# Altium project HS-IO Baseboard.PrjPcb
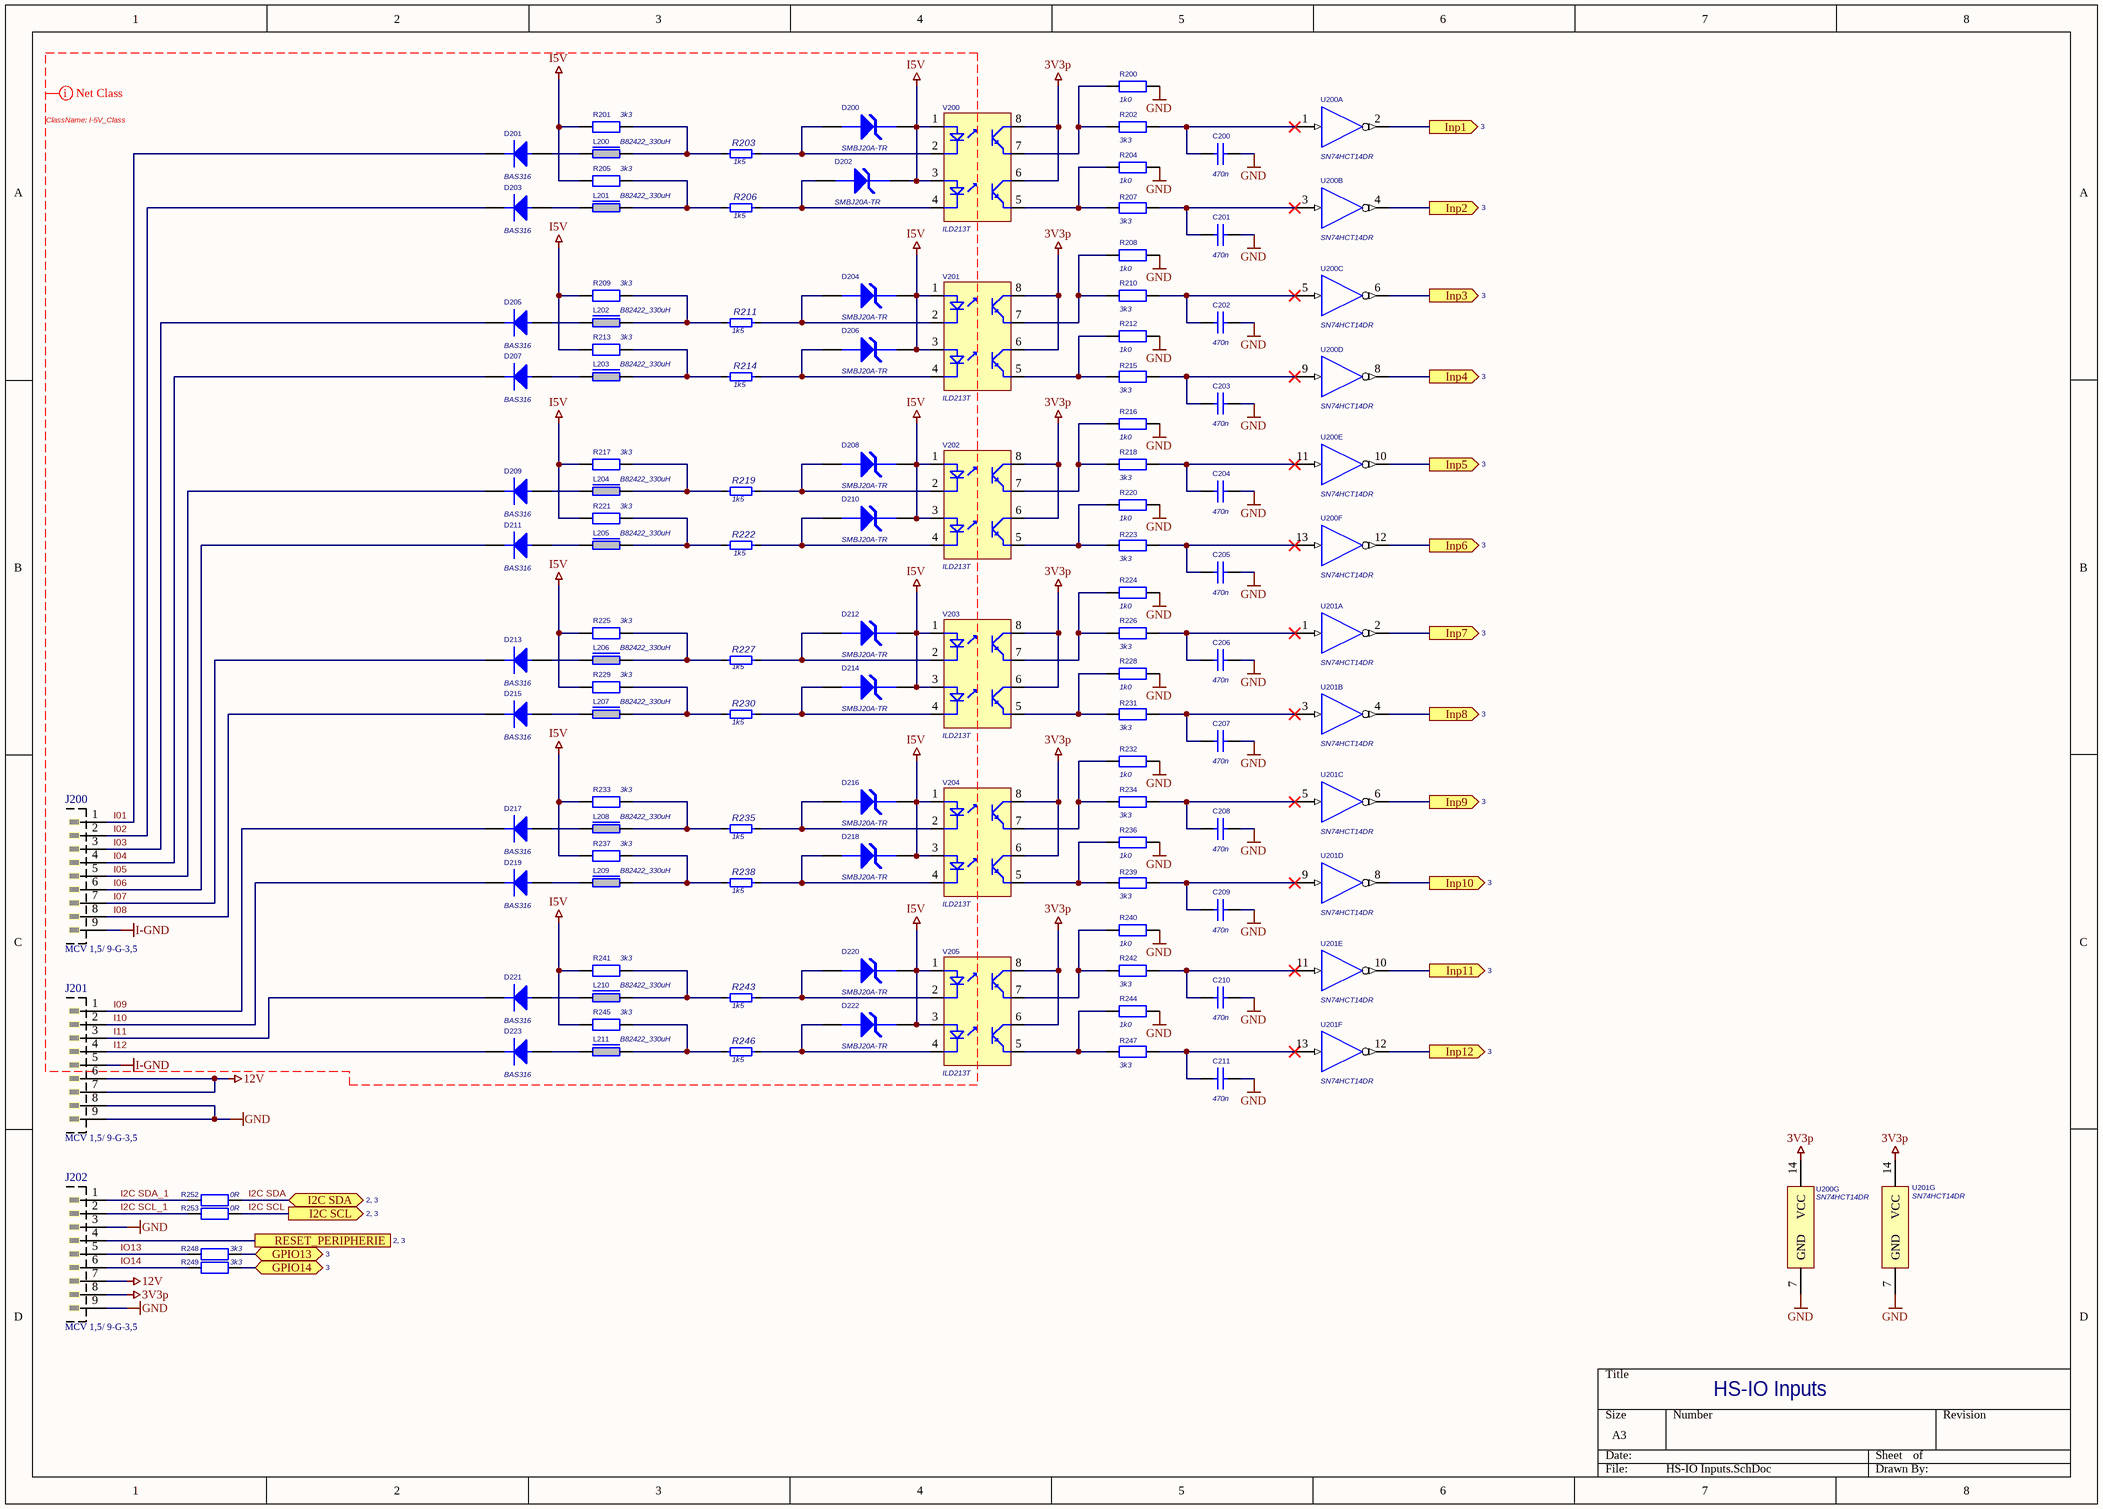
[diagram p0: HS-IO Inputs.SchDoc]
Designer: S .Waltersberger; Version: 1.1
3 sheets, 214 parts. Net scope: flat (ports and power ports of the same name join across sheets).
Board file: HS-IO-BaseBoard.PcbDoc
Sheets:
  HS-IO Inputs.SchDoc
  HS-IO Outputs.SchDoc
  HS-IO ESP32.SchDoc

## Sheet HS-IO Inputs.SchDoc
size A3; SheetNumber: 1; SheetTotal: 3

### Parts
C200  470n  [CC1608-0603]
C201  470n  [CC1608-0603]
C202  470n  [CC1608-0603]
C203  470n  [CC1608-0603]
C204  470n  [CC1608-0603]
C205  470n  [CC1608-0603]
C206  470n  [CC1608-0603]
C207  470n  [CC1608-0603]
C208  470n  [CC1608-0603]
C209  470n  [CC1608-0603]
C210  470n  [CC1608-0603]
C211  470n  [CC1608-0603]
D200  SMBJ20A-TR  [SMB]
D201  BAS316  [SOD323F]
D202  SMBJ20A-TR  [SMB]
D203  BAS316  [SOD323F]
D204  SMBJ20A-TR  [SMB]
D205  BAS316  [SOD323F]
D206  SMBJ20A-TR  [SMB]
D207  BAS316  [SOD323F]
D208  SMBJ20A-TR  [SMB]
D209  BAS316  [SOD323F]
D210  SMBJ20A-TR  [SMB]
D211  BAS316  [SOD323F]
D212  SMBJ20A-TR  [SMB]
D213  BAS316  [SOD323F]
D214  SMBJ20A-TR  [SMB]
D215  BAS316  [SOD323F]
D216  SMBJ20A-TR  [SMB]
D217  BAS316  [SOD323F]
D218  SMBJ20A-TR  [SMB]
D219  BAS316  [SOD323F]
D220  SMBJ20A-TR  [SMB]
D221  BAS316  [SOD323F]
D222  SMBJ20A-TR  [SMB]
D223  BAS316  [SOD323F]
J200  MCV 1,5/ 9-G-3,5  [MCV1,5/9-G-3,5 - I]
J201  MCV 1,5/ 9-G-3,5  [MCV1,5/9-G-3,5 - I]
J202  MCV 1,5/ 9-G-3,5  [MCV1,5/9-G-3,5 - I]
L200  B82422_330uH  [CR3225-1210]
L201  B82422_330uH  [CR3225-1210]
L202  B82422_330uH  [CR3225-1210]
L203  B82422_330uH  [CR3225-1210]
L204  B82422_330uH  [CR3225-1210]
L205  B82422_330uH  [CR3225-1210]
L206  B82422_330uH  [CR3225-1210]
L207  B82422_330uH  [CR3225-1210]
L208  B82422_330uH  [CR3225-1210]
L209  B82422_330uH  [CR3225-1210]
L210  B82422_330uH  [CR3225-1210]
L211  B82422_330uH  [CR3225-1210]
R200  1k0  [CR1608-0603]
R201  3k3  [CR1608-0603]
R202  3k3  [CR1608-0603]
R203  1k5  [CR1608-0603]
R204  1k0  [CR1608-0603]
R205  3k3  [CR1608-0603]
R206  1k5  [CR1608-0603]
R207  3k3  [CR1608-0603]
R208  1k0  [CR1608-0603]
R209  3k3  [CR1608-0603]
R210  3k3  [CR1608-0603]
R211  1k5  [CR1608-0603]
R212  1k0  [CR1608-0603]
R213  3k3  [CR1608-0603]
R214  1k5  [CR1608-0603]
R215  3k3  [CR1608-0603]
R216  1k0  [CR1608-0603]
R217  3k3  [CR1608-0603]
R218  3k3  [CR1608-0603]
R219  1k5  [CR1608-0603]
R220  1k0  [CR1608-0603]
R221  3k3  [CR1608-0603]
R222  1k5  [CR1608-0603]
R223  3k3  [CR1608-0603]
R224  1k0  [CR1608-0603]
R225  3k3  [CR1608-0603]
R226  3k3  [CR1608-0603]
R227  1k5  [CR1608-0603]
R228  1k0  [CR1608-0603]
R229  3k3  [CR1608-0603]
R230  1k5  [CR1608-0603]
R231  3k3  [CR1608-0603]
R232  1k0  [CR1608-0603]
R233  3k3  [CR1608-0603]
R234  3k3  [CR1608-0603]
R235  1k5  [CR1608-0603]
R236  1k0  [CR1608-0603]
R237  3k3  [CR1608-0603]
R238  1k5  [CR1608-0603]
R239  3k3  [CR1608-0603]
R240  1k0  [CR1608-0603]
R241  3k3  [CR1608-0603]
R242  3k3  [CR1608-0603]
R243  1k5  [CR1608-0603]
R244  1k0  [CR1608-0603]
R245  3k3  [CR1608-0603]
R246  1k5  [CR1608-0603]
R247  3k3  [CR1608-0603]
R248  3k3  [CR1608-0603]
R249  3k3  [CR1608-0603]
R252  0R  [CR1608-0603]
R253  0R  [CR1608-0603]
U200  SN74HCT14DR  [SO14]  (parts A,B,C,D,E,F,G of 7)
U201  SN74HCT14DR  [SO14]  (parts A,B,C,D,E,F,G of 7)
V200  ILD213T  [SOIC8]
V201  ILD213T  [SOIC8]
V202  ILD213T  [SOIC8]
V203  ILD213T  [SOIC8]
V204  ILD213T  [SOIC8]
V205  ILD213T  [SOIC8]

### Ports
GPIO13 (bidir, see 3), GPIO14 (bidir, see 3), I2C SCL (out, see 2, 3), I2C SDA (bidir, see 2, 3), Inp1 (out, see 3), Inp2 (out, see 3), Inp3 (out, see 3), Inp4 (out, see 3), Inp5 (out, see 3), Inp6 (out, see 3), Inp7 (out, see 3), Inp8 (out, see 3), Inp9 (out, see 3), Inp10 (out, see 3), Inp11 (out, see 3), Inp12 (out, see 3), RESET_PERIPHERIE (see 2, 3)

### Nets
3V3p: J202.8 U200.14(VCC) U201.14(VCC) V200.6 V200.8(Vcc) V201.6 V201.8(Vcc) V202.6 V202.8(Vcc) V203.6 V203.8(Vcc) V204.6 V204.8(Vcc) V205.6 V205.8(Vcc)
12V: J201.6 J201.7 J202.7
GND: C200.2 C201.2 C202.2 C203.2 C204.2 C205.2 C206.2 C207.2 C208.2 C209.2 C210.2 C211.2 J201.8 J201.9 J202.3 J202.9 R200.2 R204.2 R208.2 R212.2 R216.2 R220.2 R224.2 R228.2 R232.2 R236.2 R240.2 R244.2 U200.7(GND) U201.7(GND)
I5V: D200.2(K) D202.2(K) D204.2(K) D206.2(K) D208.2(K) D210.2(K) D212.2(K) D214.2(K) D216.2(K) D218.2(K) D220.2(K) D222.2(K) R201.1 R205.1 R209.1 R213.1 R217.1 R221.1 R225.1 R229.1 R233.1 R237.1 R241.1 R245.1 V200.1 V200.3 V201.1 V201.3 V202.1 V202.3 V203.1 V203.3 V204.1 V204.3 V205.1 V205.3
I-GND: J200.9 J201.5
GPIO13: R248.2 ; port GPIO13
GPIO14: R249.2 ; port GPIO14
I01: D201.2(K) J200.1
I02: D203.2(K) J200.2
I2C SCL: R253.2 ; port I2C SCL
I2C SCL_1: J202.2 R253.1
I2C SDA: R252.2 ; port I2C SDA
I2C SDA_1: J202.1 R252.1
I03: D205.2(K) J200.3
I04: D207.2(K) J200.4
I05: D209.2(K) J200.5
I06: D211.2(K) J200.6
I07: D213.2(K) J200.7
I08: D215.2(K) J200.8
I09: D217.2(K) J201.1
I10: D219.2(K) J201.2
I11: D221.2(K) J201.3
I12: D223.2(K) J201.4
INP1: U200.2(Y) ; port Inp1
INP2: U200.4(Y) ; port Inp2
INP3: U200.6(Y) ; port Inp3
INP4: U200.8(Y) ; port Inp4
INP5: U200.10(Y) ; port Inp5
INP6: U200.12(Y) ; port Inp6
INP7: U201.2(Y) ; port Inp7
INP8: U201.4(Y) ; port Inp8
INP9: U201.6(Y) ; port Inp9
INP10: U201.8(Y) ; port Inp10
INP11: U201.10(Y) ; port Inp11
INP12: U201.12(Y) ; port Inp12
IO13: J202.5 R248.1
IO14: J202.6 R249.1
~{RESET}: J202.4 ; port RESET_PERIPHERIE
NetC200_1: C200.1 R202.2 U200.1(A)
NetC201_1: C201.1 R207.2 U200.3(A)
NetC202_1: C202.1 R210.2 U200.5(A)
NetC203_1: C203.1 R215.2 U200.9(A)
NetC204_1: C204.1 R218.2 U200.11(A)
NetC205_1: C205.1 R223.2 U200.13(A)
NetC206_1: C206.1 R226.2 U201.1(A)
NetC207_1: C207.1 R231.2 U201.3(A)
NetC208_1: C208.1 R234.2 U201.5(A)
NetC209_1: C209.1 R239.2 U201.9(A)
NetC210_1: C210.1 R242.2 U201.11(A)
NetC211_1: C211.1 R247.2 U201.13(A)
NetD200_1: D200.1(A) R203.2 V200.2
NetD201_1: D201.1(A) L200.1
NetD202_1: D202.1(A) R206.2 V200.4
NetD203_1: D203.1(A) L201.1
NetD204_1: D204.1(A) R211.2 V201.2
NetD205_1: D205.1(A) L202.1
NetD206_1: D206.1(A) R214.2 V201.4
NetD207_1: D207.1(A) L203.1
NetD208_1: D208.1(A) R219.2 V202.2
NetD209_1: D209.1(A) L204.1
NetD210_1: D210.1(A) R222.2 V202.4
NetD211_1: D211.1(A) L205.1
NetD212_1: D212.1(A) R227.2 V203.2
NetD213_1: D213.1(A) L206.1
NetD214_1: D214.1(A) R230.2 V203.4
NetD215_1: D215.1(A) L207.1
NetD216_1: D216.1(A) R235.2 V204.2
NetD217_1: D217.1(A) L208.1
NetD218_1: D218.1(A) R238.2 V204.4
NetD219_1: D219.1(A) L209.1
NetD220_1: D220.1(A) R243.2 V205.2
NetD221_1: D221.1(A) L210.1
NetD222_1: D222.1(A) R246.2 V205.4
NetD223_1: D223.1(A) L211.1
NetL200_2: L200.2 R201.2 R203.1
NetL201_2: L201.2 R205.2 R206.1
NetL202_2: L202.2 R209.2 R211.1
NetL203_2: L203.2 R213.2 R214.1
NetL204_2: L204.2 R217.2 R219.1
NetL205_2: L205.2 R221.2 R222.1
NetL206_2: L206.2 R225.2 R227.1
NetL207_2: L207.2 R229.2 R230.1
NetL208_2: L208.2 R233.2 R235.1
NetL209_2: L209.2 R237.2 R238.1
NetL210_2: L210.2 R241.2 R243.1
NetL211_2: L211.2 R245.2 R246.1
NetR200_1: R200.1 R202.1 V200.7
NetR204_1: R204.1 R207.1 V200.5
NetR208_1: R208.1 R210.1 V201.7
NetR212_1: R212.1 R215.1 V201.5
NetR216_1: R216.1 R218.1 V202.7
NetR220_1: R220.1 R223.1 V202.5
NetR224_1: R224.1 R226.1 V203.7
NetR228_1: R228.1 R231.1 V203.5
NetR232_1: R232.1 R234.1 V204.7
NetR236_1: R236.1 R239.1 V204.5
NetR240_1: R240.1 R242.1 V205.7
NetR244_1: R244.1 R247.1 V205.5

### Layout directives
net class I-5V_Class: I01, I02, I03, I04, I05, I5V, I06, I07, I08, I09, I10, I11, I12, I-GND

### Notes on the sheet
- HS-IO Inputs

### Library data of the parts
C200-C211 = CMP-018-000014-2: SMD0603, X7R, 15%, 50V, 470nF; Manufacturer: KEMET; Manufacturer Part Number: C0805C474K5RACAUTO; Kommentar: Kondensator aus mehreren Keramikschichten MLCC - SMD/SMT 50V 0.47uF X7R 0805 10% AEC-Q200; ComponentLink1Description: Manufacturer Link; ComponentLink1URL: https://www.kemet.com; ComponentLink2Description: Datasheet; ComponentLink2URL: https://www.mouser.de/datasheet/2/447/KEM_C1023_X7R_AUTO_SMD-3316698.pdf; Supplier Order Number: 80-C0805C474K5RAUTO; Supplier Price 100pcs: 0,084 €; E01_Value_1: 470n; Supplier: Mouser
D200 D202 D204 D206 D208 D210 D212 D214 D216 D218 D220 D222 = SMBJ20A: 20V UNIDIRECTIONAL TRANSIENT VOLTAGE SUPPRESSOR; Manufacturer: STMicroelectronics; Kommentar: ESD-Entstörer/TVS-Dioden Transil; ComponentLink1Description: Manufacturer Link; ComponentLink1URL: https://www.st.com/; ComponentLink2Description: Datasheet; ComponentLink2URL: https://www.mouser.de/datasheet/2/389/cd00001366-1795574.pdf; E01_Value_1: SMBJ20A-TR; Manufacturer Part Number: SMBJ20A-TR; Supplier: Mouser; Supplier Order Number: 511-SMBJ20A-TR; Supplier Price 100pcs: 0,24 €
D201 D203 D205 D207 D209 D211 D213 D215 D217 D219 D221 D223 = BAS316: Small Signal Fast Switching Diodes 250mA; Manufacturer: Nexperia; Manufacturer Part Number: BAS316,135; Kommentar: Dioden (Allzweck, Leistung, Schaltung) BAS316/SOD323/SOD2; ComponentLink1Description: Manufacturer Link; ComponentLink1URL: https://www.nxp.com/; ComponentLink2Description: Datasheet; ComponentLink2URL: https://www.mouser.de/datasheet/2/916/BAS316-3081362.pdf; E01_Value_1: BAS316; Supplier: Mouser; Supplier Order Number: 771-BAS316135; Supplier Price 100pcs: 0,034 €
J200-J202 = CMP-019-000007-1: Phoneix Contact 9 pole connector Male RM3,5; Manufacturer Part Number: 1843677; Manufacturer: Phoenix Contact; Kommentar: Steckbare Anschlussblöcke 9 Pos 3.5mm pitch Through Hole Header; E01_Value_1: MCV 1,5/ 9-G-3,5; ComponentLink1URL: http://www.phoenixcontact.de/; ComponentLink2Description: Datasheet; Supplier Order Number: 651-1843677; ComponentLink1Description: Manufacturer Link; Supplier Price 100pcs: 2,81 €; ComponentLink2URL: https://www.phoenixcontact.com/us/products/1843677/pdf; Supplier: Mouser
L200-L211 = CMP-023-000002-2: HF-Induktivitäten – SMD SMT-INDUCTOR1210-H 330UH 5%, AEC-Q200; Manufacturer: EPCOS / TDK; Manufacturer Part Number: B82422H1334J000; E01_Value_1: B82422-H1334; ComponentLink1Description: Manufacturer Link; ComponentLink1URL: https://www.tdk-electronics.tdk.com; ComponentLink2Description: Datasheet; ComponentLink2URL: https://product.tdk.com/system/files/dam/doc/product/inductor/inductor/smd/data_sheet/30/db/ind_2008/b82422h.pdf?ref_disty=mouser; Supplier Order Number: 871-B82422H1334J000; Supplier Price 100pcs: 0,32 €; Kommentar: HF-Induktivitäten – SMD SMT-INDUCTOR1210-H 330UH 5%, AEC-Q200; Supplier: Mouser
R200 R204 R208 R212 R216 R220 R224 R228 R232 R236 R240 R244 = S0603_1k0_1_1: SMD0603, 0.1W, TK100, 1%, 1,0k, Metallfilm; Manufacturer: Vishay / Dale; Manufacturer Part Number: CRCW06031K00FKEAC; Kommentar: Dickfilmwiderstände - SMD 1/10Watt 1Kohms 1% Commercial Use; ComponentLink1Description: Manufacturer Link; ComponentLink2Description: Datasheet; ComponentLink2URL: https://www.vishay.com/docs/20035/dcrcwe3.pdf; Supplier: Mouser; Supplier Order Number: 71-CRCW06031K00FKEAC; Supplier Price 100pcs: 0,007 €; E01_Value_1: 1k0; ComponentLink1URL: https://www.vishay.com/
R201 R202 R205 R207 R209 R210 R213 R215 R217 R218 R221 R223 R225 R226 R229 R231 R233 R234 R237 R239 R241 R242 R245 R247-R249 = S0603_3k3_1: Resistor; Manufacturer: Vishay / Dale; Manufacturer Part Number: CRCW06033K30FKEBC; Kommentar: Dickfilmwiderstände - SMD 1/10Watt 3.3Kohms 1% Commercial Use; ComponentLink1Description: Manufacturer Link; ComponentLink1URL: https://www.vishay.com/; ComponentLink2Description: Datasheet; ComponentLink2URL: https://www.vishay.com/docs/20035/dcrcwe3.pdf; E01_Value_1: 3k3; Supplier: Mouser; Supplier Order Number: 71-CRCW06033K30FKEBC; Supplier Price 100pcs: 0,012 €
R203 R206 R211 R214 R219 R222 R227 R230 R235 R238 R243 R246 = CMP-012-000010-3: Resistor; Manufacturer: Vishay / Dale; Manufacturer Part Number: CRCW06031K50FKEAC; Kommentar: Dickfilmwiderstände - SMD 1/10Watt 1.5Kohms 1% Commercial Use; ComponentLink1Description: Manufacturer Link; ComponentLink1URL: https://www.vishay.com/; ComponentLink2Description: Datasheet; ComponentLink2URL: https://www.vishay.com/docs/20035/dcrcwe3.pdf; E01_Value_1: 1k5; Supplier Order Number: 71-CRCW06031K50FKEAC; Supplier Price 100pcs: 0,008 €; Supplier: Mouser
R252 R253 = CMP-038-000000-2: SMD0603, 0.1W, TK100, 1%, 0 Ohm, Metallfilm; Manufacturer Part Number: MCT0603MZ0000ZP500; Manufacturer: Vishay / Beyschlag; Kommentar: Dünnfilmwiderstände - SMD .1W ZEROohm Jumper; ComponentLink1URL: https://www.vishay.com/; Supplier Price 100pcs: 0,052 €; Supplier Order Number: 594-MCT0603MZ0000ZP5; ComponentLink2URL: https://www.vishay.com/docs/28952/mcs0402at-mct0603at-mcu0805at-mca1206at.pdf; ComponentLink2Description: Datasheet; ComponentLink1Description: Manufacturer Link; E01_Value_1: 0R; Supplier: Mouser
U200 U201 = 74HCT14D: Hex Schmitt-Trigger Inverter; Manufacturer: Texas Instruments; Kommentar: Inverter Hex Schmitt-Trigger Inverter; ComponentLink1Description: Manufacturer Link; ComponentLink1URL: https://www.nxp.com/; ComponentLink2Description: Datasheet; ComponentLink2URL: https://www.ti.com/lit/gpn/sn74hct14; E01_Value_1: SN74HCT14DR; Manufacturer Part Number: SN74HCT14DR; Supplier: Mouser; Supplier Order Number: 595-SN74HCT14DR; Supplier Price 100pcs: 0,119 €
V200-V205 = ILD213T: Dual SMD Optocoupler CTR > 100%; Manufacturer: Vishay Semiconductors; Kommentar: Transistor-Ausgangsoptokoppler Phototransistor Out Dual CTR >100%; ComponentLink1Description: Manufacturer Link; ComponentLink1URL: https://www.vishay.com/; ComponentLink2Description: Datasheet; ComponentLink2URL: https://www.vishay.com/doc?83647; E01_Value_1: ILD213T; Manufacturer Part Number: ILD213T; Supplier: Mouser; Supplier Order Number: 782-ILD213T; Supplier Price 100pcs: 0,586 €

## Sheet HS-IO Outputs.SchDoc
size A3; SheetNumber: 2; SheetTotal: 3
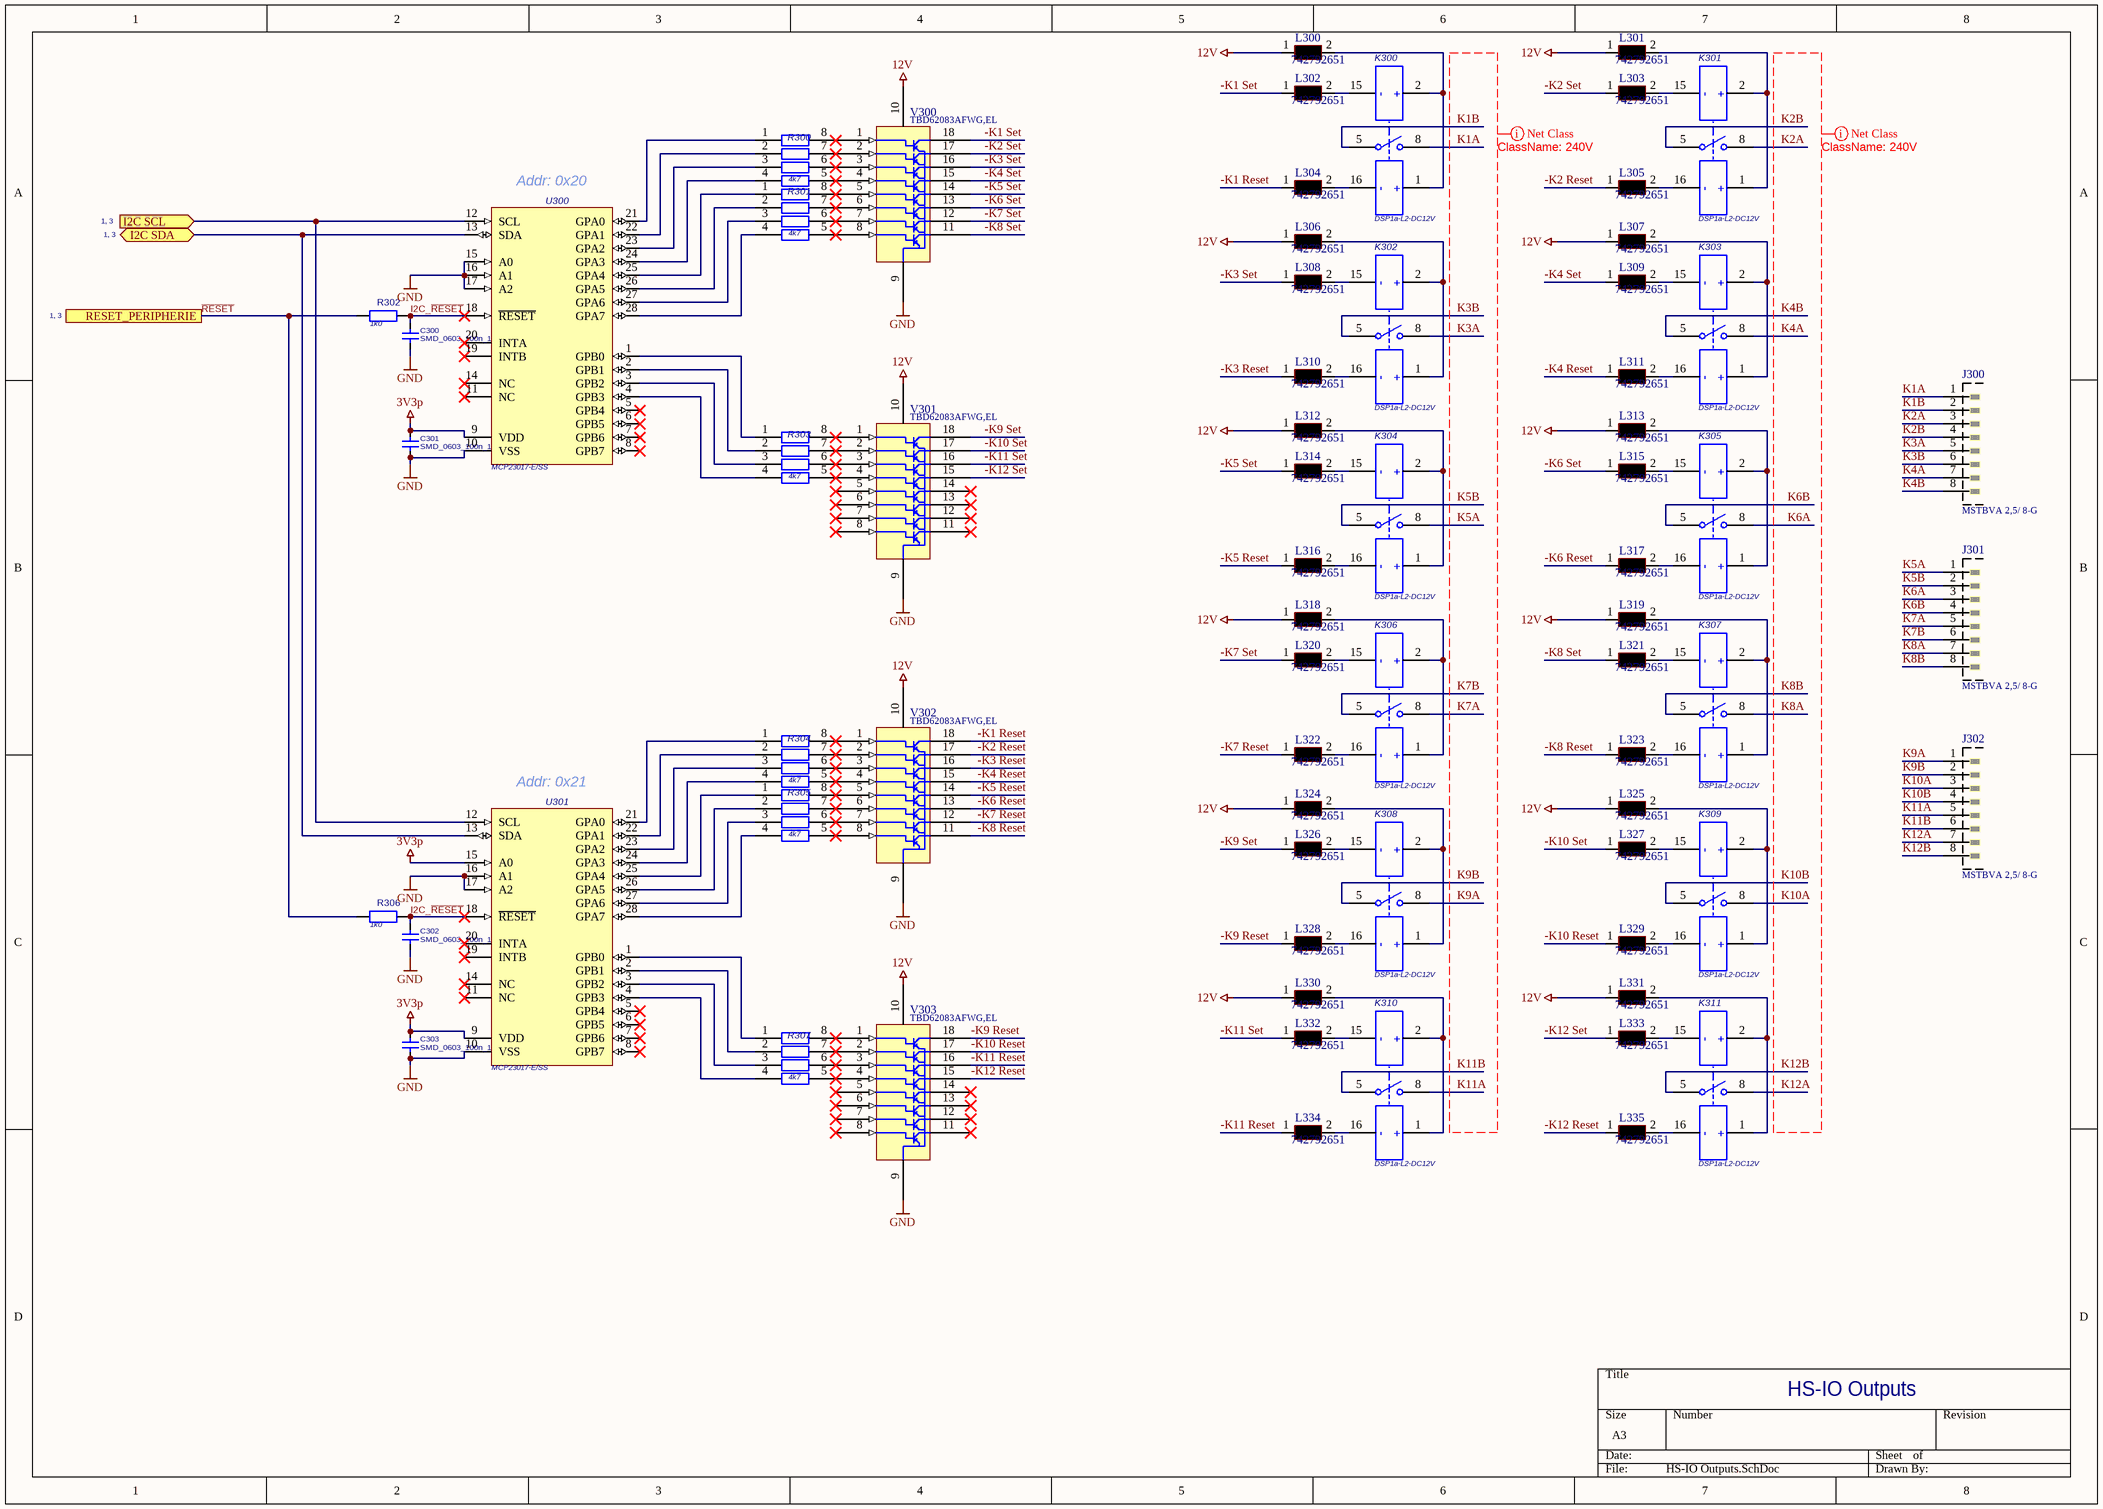
[diagram p1: HS-IO Outputs.SchDoc]

### Parts
C300  SMD_0603_100n_1  [CC1608-0603]
C301  SMD_0603_100n_1  [CC1608-0603]
C302  SMD_0603_100n_1  [CC1608-0603]
C303  SMD_0603_100n_1  [CC1608-0603]
J300  MSTBVA 2,5/ 8-G  [MSTBVA2,5/8-G - I]
J301  MSTBVA 2,5/ 8-G  [MSTBVA2,5/8-G - I]
J302  MSTBVA 2,5/ 8-G  [MSTBVA2,5/8-G - I]
K300  DSP1a-L2-DC12V  [DS-P16]
K301  DSP1a-L2-DC12V  [DS-P16]
K302  DSP1a-L2-DC12V  [DS-P16]
K303  DSP1a-L2-DC12V  [DS-P16]
K304  DSP1a-L2-DC12V  [DS-P16]
K305  DSP1a-L2-DC12V  [DS-P16]
K306  DSP1a-L2-DC12V  [DS-P16]
K307  DSP1a-L2-DC12V  [DS-P16]
K308  DSP1a-L2-DC12V  [DS-P16]
K309  DSP1a-L2-DC12V  [DS-P16]
K310  DSP1a-L2-DC12V  [DS-P16]
K311  DSP1a-L2-DC12V  [DS-P16]
L300  742792651  [0603-Ferrit]
L301  742792651  [0603-Ferrit]
L302  742792651  [0603-Ferrit]
L303  742792651  [0603-Ferrit]
L304  742792651  [0603-Ferrit]
L305  742792651  [0603-Ferrit]
L306  742792651  [0603-Ferrit]
L307  742792651  [0603-Ferrit]
L308  742792651  [0603-Ferrit]
L309  742792651  [0603-Ferrit]
L310  742792651  [0603-Ferrit]
L311  742792651  [0603-Ferrit]
L312  742792651  [0603-Ferrit]
L313  742792651  [0603-Ferrit]
L314  742792651  [0603-Ferrit]
L315  742792651  [0603-Ferrit]
L316  742792651  [0603-Ferrit]
L317  742792651  [0603-Ferrit]
L318  742792651  [0603-Ferrit]
L319  742792651  [0603-Ferrit]
L320  742792651  [0603-Ferrit]
L321  742792651  [0603-Ferrit]
L322  742792651  [0603-Ferrit]
L323  742792651  [0603-Ferrit]
L324  742792651  [0603-Ferrit]
L325  742792651  [0603-Ferrit]
L326  742792651  [0603-Ferrit]
L327  742792651  [0603-Ferrit]
L328  742792651  [0603-Ferrit]
L329  742792651  [0603-Ferrit]
L330  742792651  [0603-Ferrit]
L331  742792651  [0603-Ferrit]
L332  742792651  [0603-Ferrit]
L333  742792651  [0603-Ferrit]
L334  742792651  [0603-Ferrit]
L335  742792651  [0603-Ferrit]
R300  4k7  [ARV241]
R301  4k7  [ARV241]
R302  1k0  [CR1608-0603]
R303  4k7  [ARV241]
R304  4k7  [ARV241]
R305  4k7  [ARV241]
R306  1k0  [CR1608-0603]
R307  4k7  [ARV241]
U300  MCP23017-E/SS  [SSOP-SS28_M]
U301  MCP23017-E/SS  [SSOP-SS28_M]
V300  TBD62083AFWG,EL  [SOL-18]
V301  TBD62083AFWG,EL  [SOL-18]
V302  TBD62083AFWG,EL  [SOL-18]
V303  TBD62083AFWG,EL  [SOL-18]

### Ports
I2C SCL (in, see 1, 3), I2C SDA (bidir, see 1, 3), RESET_PERIPHERIE (see 1, 3)

### Nets
3V3p: C301.2 C303.2 U300.9(VDD) U301.9(VDD) U301.15(A0)
12V: L300.1 L301.1 L306.1 L307.1 L312.1 L313.1 L318.1 L319.1 L324.1 L325.1 L330.1 L331.1 V300.10 V301.10 V302.10 V303.10
GND: C300.1 C301.1 C302.1 C303.1 U300.10(VSS) U300.15(A0) U300.16(A1) U300.17(A2) U301.10(VSS) U301.16(A1) U301.17(A2) V300.9 V301.9 V302.9 V303.9
-K1 Reset: L304.1 V302.18
-K1 Set: L302.1 V300.18
-K2 Reset: L305.1 V302.17
-K2 Set: L303.1 V300.17
-K3 Reset: L310.1 V302.16
-K3 Set: L308.1 V300.16
-K4 Reset: L311.1 V302.15
-K4 Set: L309.1 V300.15
-K5 Reset: L316.1 V302.14
-K5 Set: L314.1 V300.14
-K6 Reset: L317.1 V302.13
-K6 Set: L315.1 V300.13
-K7 Reset: L322.1 V302.12
-K7 Set: L320.1 V300.12
-K8 Reset: L323.1 V302.11
-K8 Set: L321.1 V300.11
-K9 Reset: L328.1 V303.18
-K9 Set: L326.1 V301.18
-K10 Reset: L329.1 V303.17
-K10 Set: L327.1 V301.17
-K11 Reset: L334.1 V303.16
-K11 Set: L332.1 V301.16
-K12 Reset: L335.1 V303.15
-K12 Set: L333.1 V301.15
I2C SCL: U300.12(SCL) U301.12(SCL) ; port I2C SCL
I2C SDA: U300.13(SDA) U301.13(SDA) ; port I2C SDA
I2C_~{RESET}: C300.2 C302.2 R302.1 R306.1 U300.18(~{RESET}) U301.18(~{RESET})
K1A: J300.1 K300.8
K1B: J300.2 K300.5
K2A: J300.3 K301.8
K2B: J300.4 K301.5
K3A: J300.5 K302.8
K3B: J300.6 K302.5
K4A: J300.7 K303.8
K4B: J300.8 K303.5
K5A: J301.1 K304.8
K5B: J301.2 K304.5
K6A: J301.3 K305.8
K6B: J301.4 K305.5
K7A: J301.5 K306.8
K7B: J301.6 K306.5
K8A: J301.7 K307.8
K8B: J301.8 K307.5
K9A: J302.1 K308.8
K9B: J302.2 K308.5
K10A: J302.3 K309.8
K10B: J302.4 K309.5
K11A: J302.5 K310.8
K11B: J302.6 K310.5
K12A: J302.7 K311.8
K12B: J302.8 K311.5
~{RESET}: R302.2 R306.2 ; port RESET_PERIPHERIE
NetK300_1: K300.1(pos1) K300.2(pos2) L300.2
NetK300_15: K300.15(neg2) L302.2
NetK300_16: K300.16(neg1) L304.2
NetK301_1: K301.1(pos1) K301.2(pos2) L301.2
NetK301_15: K301.15(neg2) L303.2
NetK301_16: K301.16(neg1) L305.2
NetK302_1: K302.1(pos1) K302.2(pos2) L306.2
NetK302_15: K302.15(neg2) L308.2
NetK302_16: K302.16(neg1) L310.2
NetK303_1: K303.1(pos1) K303.2(pos2) L307.2
NetK303_15: K303.15(neg2) L309.2
NetK303_16: K303.16(neg1) L311.2
NetK304_1: K304.1(pos1) K304.2(pos2) L312.2
NetK304_15: K304.15(neg2) L314.2
NetK304_16: K304.16(neg1) L316.2
NetK305_1: K305.1(pos1) K305.2(pos2) L313.2
NetK305_15: K305.15(neg2) L315.2
NetK305_16: K305.16(neg1) L317.2
NetK306_1: K306.1(pos1) K306.2(pos2) L318.2
NetK306_15: K306.15(neg2) L320.2
NetK306_16: K306.16(neg1) L322.2
NetK307_1: K307.1(pos1) K307.2(pos2) L319.2
NetK307_15: K307.15(neg2) L321.2
NetK307_16: K307.16(neg1) L323.2
NetK308_1: K308.1(pos1) K308.2(pos2) L324.2
NetK308_15: K308.15(neg2) L326.2
NetK308_16: K308.16(neg1) L328.2
NetK309_1: K309.1(pos1) K309.2(pos2) L325.2
NetK309_15: K309.15(neg2) L327.2
NetK309_16: K309.16(neg1) L329.2
NetK310_1: K310.1(pos1) K310.2(pos2) L330.2
NetK310_15: K310.15(neg2) L332.2
NetK310_16: K310.16(neg1) L334.2
NetK311_1: K311.1(pos1) K311.2(pos2) L331.2
NetK311_15: K311.15(neg2) L333.2
NetK311_16: K311.16(neg1) L335.2
NetR300_1: R300.1 U300.21(GPA0)
NetR300_2: R300.2 U300.22(GPA1)
NetR300_3: R300.3 U300.23(GPA2)
NetR300_4: R300.4 U300.24(GPA3)
NetR300_5: R300.5 V300.4
NetR300_6: R300.6 V300.3
NetR300_7: R300.7 V300.2
NetR300_8: R300.8 V300.1
NetR301_1: R301.1 U300.25(GPA4)
NetR301_2: R301.2 U300.26(GPA5)
NetR301_3: R301.3 U300.27(GPA6)
NetR301_4: R301.4 U300.28(GPA7)
NetR301_5: R301.5 V300.8
NetR301_6: R301.6 V300.7
NetR301_7: R301.7 V300.6
NetR301_8: R301.8 V300.5
NetR303_1: R303.1 U300.1(GPB0)
NetR303_2: R303.2 U300.2(GPB1)
NetR303_3: R303.3 U300.3(GPB2)
NetR303_4: R303.4 U300.4(GPB3)
NetR303_5: R303.5 V301.4
NetR303_6: R303.6 V301.3
NetR303_7: R303.7 V301.2
NetR303_8: R303.8 V301.1
NetR304_1: R304.1 U301.21(GPA0)
NetR304_2: R304.2 U301.22(GPA1)
NetR304_3: R304.3 U301.23(GPA2)
NetR304_4: R304.4 U301.24(GPA3)
NetR304_5: R304.5 V302.4
NetR304_6: R304.6 V302.3
NetR304_7: R304.7 V302.2
NetR304_8: R304.8 V302.1
NetR305_1: R305.1 U301.25(GPA4)
NetR305_2: R305.2 U301.26(GPA5)
NetR305_3: R305.3 U301.27(GPA6)
NetR305_4: R305.4 U301.28(GPA7)
NetR305_5: R305.5 V302.8
NetR305_6: R305.6 V302.7
NetR305_7: R305.7 V302.6
NetR305_8: R305.8 V302.5
NetR307_1: R307.1 U301.1(GPB0)
NetR307_2: R307.2 U301.2(GPB1)
NetR307_3: R307.3 U301.3(GPB2)
NetR307_4: R307.4 U301.4(GPB3)
NetR307_5: R307.5 V303.4
NetR307_6: R307.6 V303.3
NetR307_7: R307.7 V303.2
NetR307_8: R307.8 V303.1

Not connected (* = marked no-connect by the designer): U300 5(GPB4)* 6(GPB5)* 7(GPB6)* 8(GPB7)* 11(NC)* 14(NC)* 19(INTB)* 20(INTA)*; U301 5(GPB4)* 6(GPB5)* 7(GPB6)* 8(GPB7)* 11(NC)* 14(NC)* 19(INTB)* 20(INTA)*; V301 5* 6* 7* 8* 11* 12* 13* 14*; V303 5* 6* 7* 8* 11* 12* 13* 14*

### Layout directives
net class 240V: K1A, K1B, K2A, K2B, K3A, K3B, K4A, K4B, K5A, K5B, K6A, K6B, K7A, K7B, K8A, K8B, K9A, K9B, K10A, K10B, K11A, K11B, K12A, K12B

### Notes on the sheet
- (near U300) Addr: 0x20
- (near U301) Addr: 0x21
- HS-IO Outputs
- (in symbol CMP-015-000010-1) -; +

### Library data of the parts
C300-C303 = CMP-018-000010-5: SMD0603, X7R, 15%, 50V, 100nF; Manufacturer: KEMET; Manufacturer Part Number: C0603C104K5RAC7867; Kommentar: Kondensator aus mehreren Keramikschichten MLCC - SMD/SMT 50V 0.1uF X7R 0603 10%; E01_Value_1: 100n; Supplier Order Number: 80-C0603C104K5R7867; Supplier Price 100pcs: 0,022 €; ComponentLink2URL: https://www.mouser.de/datasheet/2/447/KEM_C1002_X7R_SMD-3316098.pdf; Supplier: Mouser; ComponentLink1Description: Manufacturer Link; ComponentLink2Description: Datasheet; ComponentLink1URL: https://www.kemet.com
J300-J302 = CMP-019-000004-1: Phoneix Contact 8 pole connector Male RM5mm; Manufacturer: Phoenix Contact; Manufacturer Part Number: 1755574; Kommentar: Steckbare Anschlussblöcke 8 Pos 5mm pitch Through Hole Header; E01_Value_1: MSTBVA 2,5/ 8-G; ComponentLink2Description: Datasheet; Supplier Order Number: 651-1755574; ComponentLink1URL: http://www.phoenixcontact.de/; ComponentLink1Description: Manufacturer Link; Supplier Price 100pcs: 1,90 €; ComponentLink2URL: https://www.phoenixcontact.com/us/products/1755574/pdf; Supplier: Mouser
K300-K311 = CMP-015-000010-1: 8 A MINIATURE BIPOLAR POWER RELAY; ComponentLink1URL: www.panasonic.com; E01_Value_1: DSP1a-L2-DC12V; Supplier Order Number: 769-DSP1A-L2-DC12V; ComponentLink1Description: Manufacturer Link; Supplier: Mouser
L300-L335 = CMP-006-00002-1: Ferritperlen WE-CBF 0603 100MHz 600Ohm 1000mA AEC-Q200; Manufacturer: Würth; E01_Value_1: 600Ohm, 1A; ComponentLink1Description: Datasheet Link; Kommentar: Ferritperlen WE-CBF 0603 100MHz 600Ohm 1000mA AEC-Q200; Supplier Order Number: 710-742792651; ComponentLink1URL: https://www.we-online.com/components/products/datasheet/742792651.pdf; Supplier Price 100pcs: 0,157 €; Manufacturer Part Number: 742792651; Supplier: Mouser
R300 R301 R303-R305 R307 = S0603x4_NET_4k7: Widerstandsnetzwerk * 4; ComponentLink1Description: Manufacturer Link; ComponentLink2Description: Datasheet; ComponentLink2URL: c:\Entwicklungen\Datenblätter\Phicomp\73105.pdf; E01_Value_1: 4k7; Supplier: Mouser; Supplier Order Number: 652-CR0603-JW-472ELF
R302 R306 = S0603_1k0_1_1: as R200 on sheet HS-IO Inputs; ComponentLink1Description: Manufacturer Link; ComponentLink2Description: Datasheet; ComponentLink2URL: https://www.vishay.com/docs/20035/dcrcwe3.pdf; Supplier: Mouser; Supplier Order Number: 71-CRCW06031K00FKEAC; Supplier Price 100pcs: 0,007 €; E01_Value_1: 1k0; ComponentLink1URL: https://www.vishay.com/
U300 U301 = CMP-015-000011-1: 16-Bit I/O Expander with Serial Interface, 28-Pin SSOP, Extended Temperature; Manufacturer: Microchip; Kommentar: Schnittstelle - I/O-Erweiterer 16bit Input/Output Exp I2C interface; ComponentLink1URL: http://www.microchip.com/; E01_Value_1: MCP23017-E/SS; ComponentLink2Description: Datasheet; Manufacturer Part Number: MCP23017-E/SS; ComponentLink2URL: http://ww1.microchip.com/downloads/en/DeviceDoc/21952b.pdf; ComponentLink1Description: Manufacturer Link; Supplier Price 100pcs: 1,19€; Supplier Order Number: 579-MCP23017-E/SS; Supplier: Mouser
V300-V303 = CMP-031-000016-1: 8-fach Darlington Transistor Array; Manufacturer: Toshiba; Kommentar: Gate-Treiber DMOS Transistor Array 8-CH, 50V/0.5A; ComponentLink2Description: Datasheet; ComponentLink1URL: https://toshiba.semicon-storage.com; Supplier Order Number: 757-TBD62083AFWGEL; Manufacturer Part Number: TBD62083AFWG,EL; ComponentLink2URL: https://www.mouser.de/datasheet/2/408/TBD62083AFWG_datasheet_en_20160511-769679.pdf; Supplier Price 100pcs: 0,707 €; ComponentLink1Description: Manufacturer Link; E01_Value_1: TBD62083AFWG,EL; Supplier: Mouser

## Sheet HS-IO ESP32.SchDoc
size A3; SheetNumber: 3; SheetTotal: 3
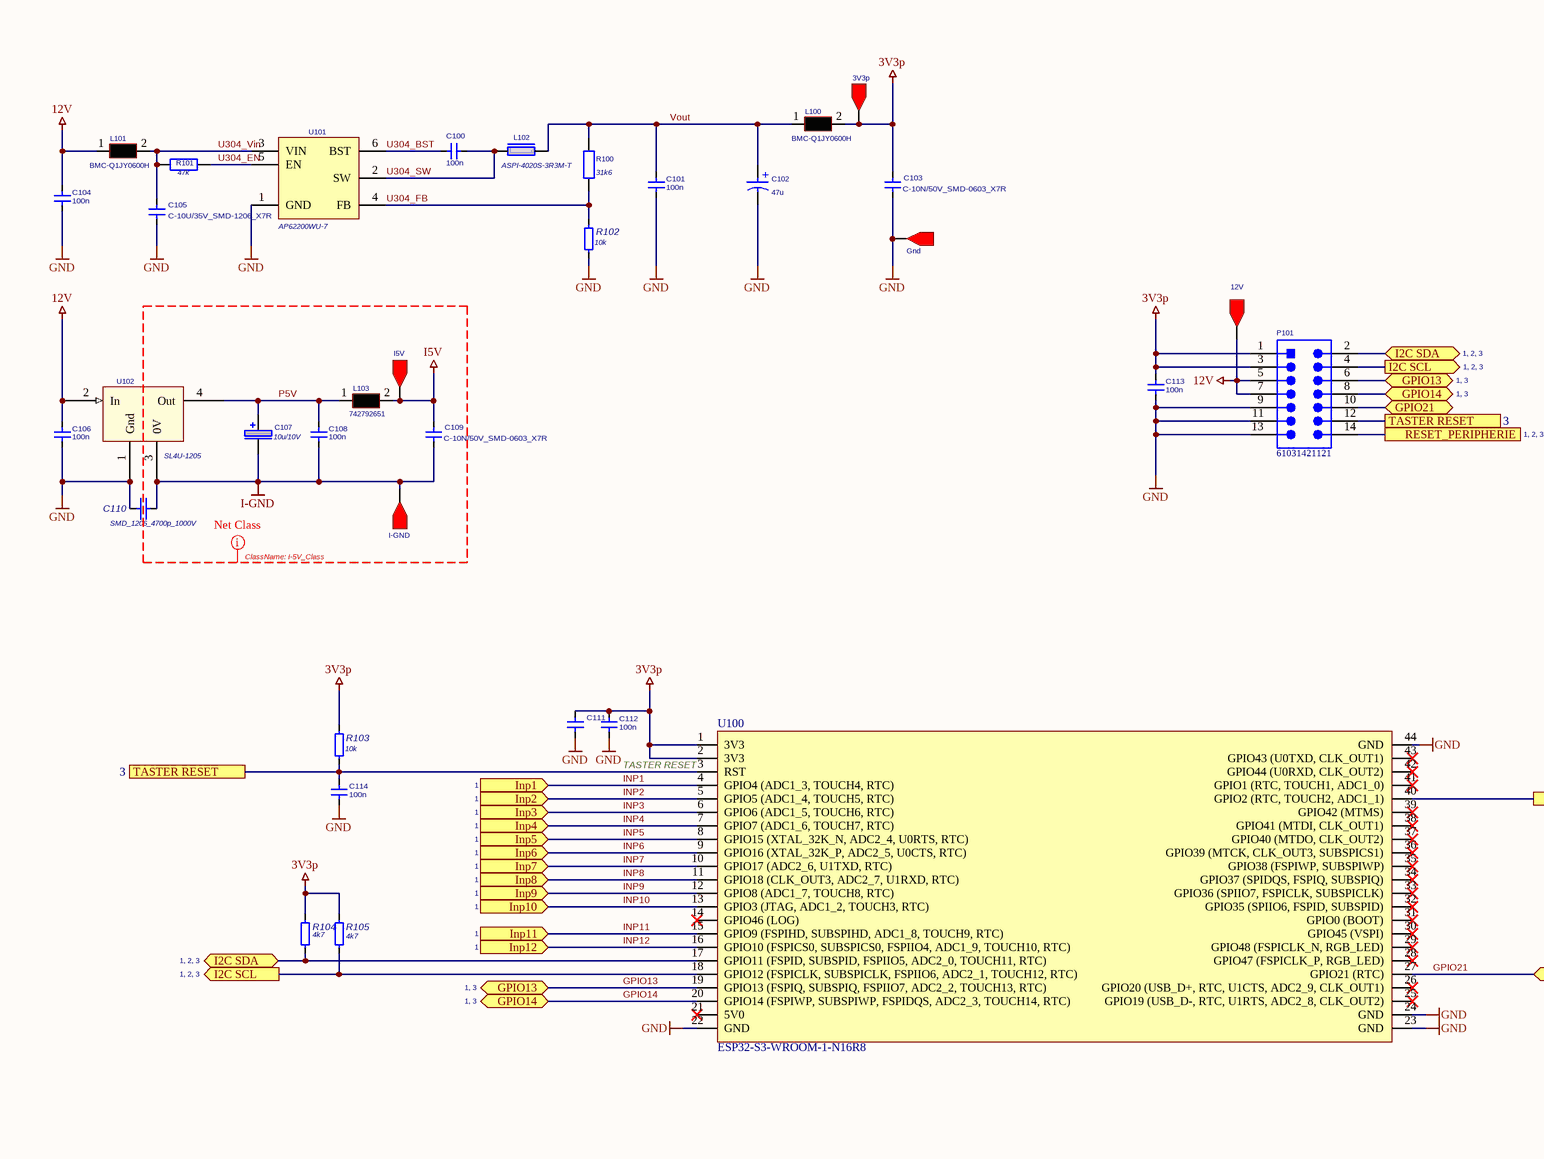
[diagram p2: HS-IO ESP32.SchDoc, left]
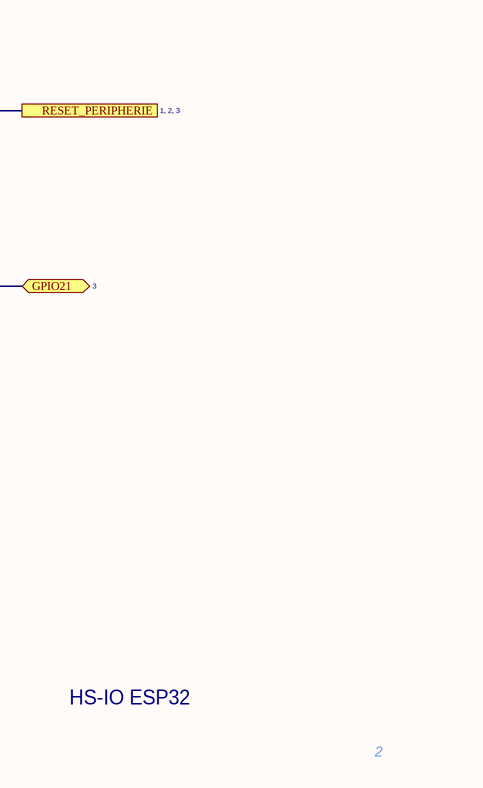
[diagram p3: HS-IO ESP32.SchDoc, right]

### Parts
3V3p  (no part)  [TESTPOINT]  (value not drawn)  (no BOM)
12V  (no part)  [TESTPOINT]  (value not drawn)  (no BOM)
C100  100n  [CC1608-0603]
C101  100n  [CC1608-0603]
C102  47u  [WCAP-PSLP_D5H5.5]
C103  C-10N/50V_SMD-0603_X7R  [0603_SMD_T]
C104  100n  [CC1608-0603]
C105  C-10U/35V_SMD-1206_X7R  [1206C_H0175_SMD_T]
C106  100n  [CC1608-0603]
C107  10u/10V  [TA-C]
C108  100n  [CC1608-0603]
C109  C-10N/50V_SMD-0603_X7R  [0603_SMD_T]
C110  SMD_1206_4700p_1000V  [CR3216-1206]
C111  C-10U/10V_SMD-0603_X5R  [CC1608-0603]  (value not drawn)
C112  100n  [CC1608-0603]
C113  100n  [CC1608-0603]
C114  100n  [CC1608-0603]
Gnd  (no part)  [TESTPOINT]  (value not drawn)  (no BOM)
I5V  (no part)  [TESTPOINT]  (value not drawn)  (no BOM)
I-GND  (no part)  [TESTPOINT]  (value not drawn)  (no BOM)
L100  BMC-Q1JY0600H  [0603-Ferrit]
L101  BMC-Q1JY0600H  [0603-Ferrit]
L102  ASPI-4020S-3R3M-T  [ASPI-4020S]
L103  742792651  [0603-Ferrit]
P101  61031421121  [61031421121]
R100  31k6  [CR1608-0603]
R101  47k  [CR1608-0603]
R102  10k  [CR1608-0603]
R103  10k  [CR1608-0603]
R104  4k7  [CC1608-0603]
R105  4k7  [CC1608-0603]
U100  ESP32-S3-WROOM-1-N16R8  [DIL-44-ESP32]
U101  AP62200WU-7  [SOT95P280X100-6N]
U102  SL4U-1205  [SIP4_6mm]

### Ports
GPIO13 (bidir, see 1, 3), GPIO14 (bidir, see 1, 3), GPIO21 (bidir, see 3), I2C SCL (out, see 1, 2, 3), I2C SDA (bidir, see 1, 2, 3), Inp1 (in, see 1), Inp2 (in, see 1), Inp3 (in, see 1), Inp4 (in, see 1), Inp5 (in, see 1), Inp6 (in, see 1), Inp7 (in, see 1), Inp8 (in, see 1), Inp9 (in, see 1), Inp10 (in, see 1), Inp11 (in, see 1), Inp12 (in, see 1), RESET_PERIPHERIE (see 1, 2, 3), TASTER RESET (see 3)

### Nets
3V3p: 3V3p.1 C103.1 C111.1 C112.2 C113.2 L100.2 P101.1 P101.3 R103.2 R104.2 R105.2 U100.1(3V3) U100.2(3V3)
12V: 12V.1 C104.1 C106.2 L101.1 P101.5 P101.7 U102.2(In)
GND: C101.1 C102.2(N) C103.2 C104.2 C105.2 C106.1 C110.1 C111.2 C112.1 C113.1 C114.1 Gnd.1 P101.9 P101.11 P101.13 R102.1 U100.22(GND) U100.23(GND) U100.24(GND) U100.44(GND) U101.1(GND) U102.1(Gnd)
I5V: C109.1 I5V.1 L103.2
I-GND: C107.2 C108.1 C109.2 C110.2 I-GND.1 U102.3(0V)
GPIO13: P101.6 U100.19(GPIO13_(FSPIQ,_SUBSPIQ,_FSPIIO7,_ADC2_2,_TOUCH13,_RTC)) ; port GPIO13
GPIO14: P101.8 U100.20(GPIO14_(FSPIWP,_SUBSPIWP,_FSPIDQS,_ADC2_3,_TOUCH14,_RTC)) ; port GPIO14
GPIO21: P101.10 U100.27(GPIO21_(RTC)) ; port GPIO21
I2C SCL: P101.4 R105.1 U100.18(GPIO12_(FSPICLK,_SUBSPICLK,_FSPIIO6,_ADC2_1,_TOUCH12,_RTC)) ; port I2C SCL
I2C SDA: P101.2 R104.1 U100.17(GPIO11_(FSPID,_SUBSPID,_FSPIIO5,_ADC2_0,_TOUCH11,_RTC)) ; port I2C SDA
INP1: U100.4(GPIO4_(ADC1_3,_TOUCH4,_RTC)) ; port Inp1
INP2: U100.5(GPIO5_(ADC1_4,_TOUCH5,_RTC)) ; port Inp2
INP3: U100.6(GPIO6_(ADC1_5,_TOUCH6,_RTC)) ; port Inp3
INP4: U100.7(GPIO7_(ADC1_6,_TOUCH7,_RTC)) ; port Inp4
INP5: U100.8(GPIO15_(XTAL_32K_N,_ADC2_4,_U0RTS,_RTC)) ; port Inp5
INP6: U100.9(GPIO16_(XTAL_32K_P,_ADC2_5,_U0CTS,_RTC)) ; port Inp6
INP7: U100.10(GPIO17_(ADC2_6,_U1TXD,_RTC)) ; port Inp7
INP8: U100.11(GPIO18_(CLK_OUT3,_ADC2_7,_U1RXD,_RTC)) ; port Inp8
INP9: U100.12(GPIO8_(ADC1_7,_TOUCH8,_RTC)) ; port Inp9
INP10: U100.13(GPIO3_(JTAG,_ADC1_2,_TOUCH3,_RTC)) ; port Inp10
INP11: U100.15(GPIO9_(FSPIHD,_SUBSPIHD,_ADC1_8,_TOUCH9,_RTC)) ; port Inp11
INP12: U100.16(GPIO10_(FSPICS0,_SUBSPICS0,_FSPIIO4,_ADC1_9,_TOUCH10,_RTC)) ; port Inp12
P5V: C107.1 C108.2 L103.1 U102.4(Out)
~{RESET}: P101.14 U100.40(GPIO2_(RTC,_TOUCH2,_ADC1_1)) ; port RESET_PERIPHERIE
TASTER RESET: C114.2 P101.12 R103.1 U100.3(RST) ; port TASTER RESET
U304_BST: C100.1 U101.6(BST)
U304_EN: R101.1 U101.5(EN)
U304_FB: R100.1 R102.2 U101.4(FB)
U304_SW: C100.2 L102.1 U101.2(SW)
U304_Vin: C105.1 L101.2 R101.2 U101.3(VIN)
Vout: C101.2 C102.1(P) L100.1 L102.2 R100.2

Not connected (* = marked no-connect by the designer): U100 14(GPIO46_(LOG))* 21(5V0)* 25(GPIO19_(USB_D-,_RTC,_U1RTS,_ADC2_8,_CLK_OUT2))* 26(GPIO20_(USB_D+,_RTC,_U1CTS,_ADC2_9,_CLK_OUT1))* 28(GPIO47_(FSPICLK_P,_RGB_LED))* 29(GPIO48_(FSPICLK_N,_RGB_LED))* 30(GPIO45_(VSPI))* 31(GPIO0_(BOOT))* 32(GPIO35_(SPIIO6,_FSPID,_SUBSPID))* 33(GPIO36_(SPIIO7,_FSPICLK,_SUBSPICLK))* 34(GPIO37_(SPIDQS,_FSPIQ,_SUBSPIQ))* 35(GPIO38_(FSPIWP,_SUBSPIWP))* 36(GPIO39_(MTCK,_CLK_OUT3,_SUBSPICS1))* 37(GPIO40_(MTDO,_CLK_OUT2))* 38(GPIO41_(MTDI,_CLK_OUT1))* 39(GPIO42_(MTMS))* 41(GPIO1_(RTC,_TOUCH1,_ADC1_0))* 42(GPIO44_(U0RXD,_CLK_OUT2))* 43(GPIO43_(U0TXD,_CLK_OUT1))*

### Layout directives
net class I-5V_Class: I5V, I-GND, P5V

### Notes on the sheet
- HS-IO ESP32
- 2
- (in symbol CMP-001-00009-1) +

### Library data of the parts
3V3p 12V Gnd I5V I-GND = CMP-029-000001-1: Test Point; Manufacturer: (no part); Manufacturer Part Number: (no part); Supplier Order Number: (no part); Supplier Price 100pcs: (no part); Kommentar: (no part); E01_Value_1: (no part); Supplier: Mouser
C100 C101 C104 C106 C108 C112-C114 = CMP-018-000010-5: SMD0603, X7R, 15%, 50V, 100nF; Manufacturer: KEMET; Manufacturer Part Number: C0603C104K5RAC7867; Kommentar: Kondensator aus mehreren Keramikschichten MLCC - SMD/SMT 50V 0.1uF X7R 0603 10%; Supplier Order Number: 80-C0603C104K5R7867; Supplier Price 100pcs: 0,022 €; ComponentLink2URL: https://www.mouser.de/datasheet/2/447/KEM_C1002_X7R_SMD-3316098.pdf; Supplier: Mouser; ComponentLink1Description: Manufacturer Link; E01_Value_1: 100n; ComponentLink2Description: Datasheet; ComponentLink1URL: https://www.kemet.com
C102 = CMP-001-00009-1: WCAP-PSLP Aluminum Polymer Capacitor, V-Chip SMT, D5 x H5.5mm, 47µF, 6.3V; Manufacturer Part Number: 875105142001; Manufacturer: Wurth Elektronik; ComponentLink1URL: https://www.we-online.com/redexpert/article/875105142001?ad; ComponentLink1Description: Website Link; ComponentLink2URL: https://www.we-online.com/redexpert/spec/875105142001?ad; ComponentLink2Description: Datasheet Link; Supplier Order Number: 710-875105142001; Supplier: Mouser
C103 C109 = CMP-046-000011-6: C 10N/50V, SMD-0603, X7R; Manufacturer: AVX GMBH; Manufacturer Part Number: 06035C103KAT2A; Supplier Order Number: 581-06035C103K; Supplier: Mouser
C105 = CMP-046-000013-5: Kondensator, MLCC, SMD 1206, 35V, 10uF, X7R,  10%; Manufacturer: TAIYO YUDEN EUR; Manufacturer Part Number: GMK316AB7106KL-TR; Supplier Price 100pcs: 0,176 €; Supplier Order Number: 963-GMK316AB7106KL; E01_Value_1: 10u/35V; Supplier: Mouser
C107 = SMD_TAA_10u_1: Tantal Elko 10uF / 10V; Manufacturer: KEMET; Manufacturer Part Number: T491C106K010AT; Kommentar: Tantalkondensatoren - fest für SMD 10V 10uF 2312 10% ESR=1.8 Ohms; ComponentLink1Description: Manufacturer Link; ComponentLink1URL: https://www.kemet.com; ComponentLink2Description: Datasheet; ComponentLink2URL: https://www.mouser.de/datasheet/2/447/KEM_T2005_T491-3316937.pdf; E01_Value_1: 10u/10V; Supplier: Mouser; Supplier Order Number: 80-T491C106K010; Supplier Price 100pcs: 0,209 €
C110 = CMP-001-00069-1: Multilayer Ceramic Capacitors MLCC - SMD/SMT 1kV 4700pF X7R 1206 10%; Manufacturer: YAGEO; Manufacturer Part Number: CC1206KKX7RCBB472; E01_Value_1: 4700p; Supplier Price 100pcs: 0,135 €; Supplier: Mouser; ComponentLink1Description: Manufacturer Link; ComponentLink2URL: https://www.mouser.de/datasheet/2/447/UPY_GPHC_X7R_6_3V_to_250V_24-3441574.pdf; ComponentLink1URL: https://www.yageo.com/en/Home; Supplier Order Number: 603-CC126KKX7RCBB472; ComponentLink2Description: Datasheet
C111 = CMP-066-000007-6: Manufacturer: TDK ELECTRONICS; Manufacturer Part Number: C1608X5R1A106M080AC; E01_Value_1: 10u; Supplier: Mouser; Supplier Order Number: 810-C1608X5R1A106M
L100 L101 = CMP-006-00001-3: Ferritperlen BMC-Q 0603 600R 25% Tol. High Current; Manufacturer: TE Connectivity; Supplier Price 100pcs: 0,095 €; Supplier: Mouser; Supplier Order Number: 710-742862160; Manufacturer Part Number: BMC-Q1JY0600H; Kommentar: Ferritperlen BMC-Q 0603 600R 25% Tol. High Current; ComponentLink1Description: Datasheet Link; ComponentLink1URL: https://www.mouser.de/datasheet/2/418/9/ENG_DS_1773178_3_A1-3474112.pdf
L102 = ASPI-4020S-3R3M-T: FIXED IND 3.3UH 1.34A 75MOHM SMD; Manufacturer: ABRACON; Kommentar: Leistungsinduktivitäten – SMD FIXED IND 3.3UH 1.4A 70 MOHM SMD; ComponentLink1Description: Manufacturer Link; ComponentLink1URL: https://abracon.com/; ComponentLink2Description: Datasheet; ComponentLink2URL: https://www.mouser.de/datasheet/2/3/ASPI-4020S-1775177.pdf; E01_Value_1: ASPI-4020S-3R3M-T; Manufacturer Part Number: ASPI-4020S-3R3M-T; Supplier: Mouser; Supplier Order Number: 815-ASPI-4020S-3R3MT; Supplier Price 100pcs: 0,143 €
L103 = CMP-006-00002-1: as L300 on sheet HS-IO Outputs; Supplier Price 100pcs: 0,157 €; Supplier: Mouser; Supplier Order Number: 710-742792651; Manufacturer Part Number: 742792651; Kommentar: Ferritperlen WE-CBF 0603 100MHz 600Ohm 1000mA AEC-Q200; ComponentLink1Description: Datasheet Link; ComponentLink1URL: https://www.we-online.com/components/products/datasheet/742792651.pdf
P101 = CMP-067-000001-1: WR-PHD Pin Header, SMT, pitch 2.54mm, Dual Row, Vertical, 14p; Manufacturer: Wurth Elektronik; Supplier Order Number: 710-61031421121; Manufacturer Part Number: 61031421121; Supplier: Mouser
R100 = S0603_31k6_1: SMD0603, 0.1W, TK100, 1%, 31.6k; Manufacturer: Vishay / Dale; Manufacturer Part Number: CRCW060331K6FKEAC; Kommentar: Dickfilmwiderstände - SMD 1/10W 31.6Kohms 1% Commercial Use; ComponentLink1Description: Manufacturer Link; ComponentLink1URL: https://www.vishay.com/; ComponentLink2Description: Datasheet; ComponentLink2URL: https://www.vishay.com/docs/20035/dcrcwe3.pdf; E01_Value_1: 31k6; Supplier: Mouser; Supplier Order Number: 71-CRCW060331K6FKEAC; Supplier Price 100pcs: 0,008 €
R101 = S0603_47k: RES 47K OHM 1% 1/10W 0603; Manufacturer: Vishay / Dale; Manufacturer Part Number: CRCW060347K0FKED; Kommentar: Dickfilmwiderstände - SMD D11/CRCW0603 100 47K 1% ET3 E3; ComponentLink1Description: Manufacturer Link; ComponentLink2Description: Datasheet; ComponentLink2URL: https://www.vishay.com/doc?28773; Supplier: Mouser; Supplier Order Number: 71-CRCW060347K0FKED; Supplier Price 100pcs: 0,012 €; E01_Value_1: 47k; ComponentLink1URL: https://www.vishay.com/
R102 R103 = CMP-027-000005-4: SMD0603, 0.1W, TK100, 1%, 10k; Manufacturer: Vishay / Dale; Manufacturer Part Number: CRCW060310K0FKEAC; Kommentar: Dickfilmwiderstände - SMD 1/10Watt 10Kohms 1% Commercial Use; Supplier Price 100pcs: 0,011 €; Supplier Order Number: 71-CRCW060310K0FKEAC; ComponentLink1Description: Manufacturer Link; ComponentLink2Description: Datasheet; ComponentLink2URL: https://www.vishay.com/docs/20035/dcrcwe3.pdf; E01_Value_1: 10K; ComponentLink1URL: https://www.vishay.com/; Supplier: Mouser
R104 R105 = CMP-038-000005-4: Dünnfilmwiderstände - SMD .1W 4.7Kohms 1% 0603 50ppm Auto; Manufacturer Part Number: MCT06030C4701FP500; Manufacturer: Vishay / Beyschlag; ComponentLink2URL: https://www.vishay.com/docs/28700/mcx0x0xpre.pdf; E01_Value_1: 4k7; Kommentar: Dünnfilmwiderstände - SMD .1W 4.7Kohms 1% 0603 50ppm Auto; ComponentLink1Description: Manufacturer Link; ComponentLink1URL: https://www.mouser.de/manufacturer/beyschlag/; Supplier Price 100pcs: 0,025 €; ComponentLink2Description: Datasheet; Supplier Order Number: 594-MCT06030C4701FP5; Supplier: Mouser
U100 = CMP-020-00001-8: SMD mod, ESP32-S3R8 with 3.3V, 8MB Octal PSRAM die insid, 6MBQuad SPI flash, pcb ant; Min Supply Voltage: 3V; Max Supply Voltage: 3.6V; Min Operating Temperature: -40°C; Max Operating Temperature: 65°C
U101 = AP62200WU-7: 4.2V TO 18V INPUT, 2A LOW IQ SYNCHRONOUS BUCK CONVERTER; Manufacturer: Diodes Incorporated; Kommentar: Schaltspannungsregler DCDC Conv HV Buck TSOT26(STD) T&R 3K; ComponentLink1Description: Manufacturer Link; ComponentLink2Description: Datasheet; ComponentLink2URL: https://www.mouser.de/datasheet/2/115/AP62200_AP62201_AP62200T-3194967.pdf; E01_Value_1: AP62200WU-7; ComponentLink1URL: https://www.diodes.com/; Manufacturer Part Number: AP62200WU-7; Supplier: Mouser; Supplier Order Number: 621-AP62200WU-7; Supplier Price 100pcs: 0,228 €
U102 = SL4U-1205: DC/DC Wandler 1W 12V/5V Isolation 1000V; Manufacturer: Floeth Electronic; Kommentar: DC-DC-Converter 12V zu 5V, 200mA; ComponentLink1Description: Manufacturer Link; ComponentLink1URL: www.floeth-electronic.com; ComponentLink2Description: Datasheet; ComponentLink2URL: https://floeth-electronic.com/wordpress/wp-content/uploads/2021/07/Seite-101-SL4U.pdf; E01_Value_1: SL4U-1205; Manufacturer Part Number: SL4U-1205; Supplier: Mouser; Supplier Order Number: SL4U-1205

## Nets that join several sheets
3V3p: HS-IO Inputs (15 pins), HS-IO Outputs (5 pins), HS-IO ESP32 (13 pins)
12V: HS-IO Inputs (J201.6 J201.7 J202.7), HS-IO Outputs (16 pins), HS-IO ESP32 (7 pins)
GND: HS-IO Inputs (30 pins), HS-IO Outputs (15 pins), HS-IO ESP32 (22 pins)
I5V: HS-IO Inputs (36 pins), HS-IO ESP32 (C109.1 I5V.1 L103.2)
I-GND: HS-IO Inputs (J200.9 J201.5), HS-IO ESP32 (6 pins)
GPIO13: HS-IO Inputs (R248.2), HS-IO ESP32 (P101.6 U100.19)
GPIO14: HS-IO Inputs (R249.2), HS-IO ESP32 (P101.8 U100.20)
I2C SCL: HS-IO Inputs (R253.2), HS-IO Outputs (U300.12 U301.12), HS-IO ESP32 (P101.4 R105.1 U100.18)
I2C SDA: HS-IO Inputs (R252.2), HS-IO Outputs (U300.13 U301.13), HS-IO ESP32 (P101.2 R104.1 U100.17)
INP1: HS-IO Inputs (U200.2), HS-IO ESP32 (U100.4)
INP2: HS-IO Inputs (U200.4), HS-IO ESP32 (U100.5)
INP3: HS-IO Inputs (U200.6), HS-IO ESP32 (U100.6)
INP4: HS-IO Inputs (U200.8), HS-IO ESP32 (U100.7)
INP5: HS-IO Inputs (U200.10), HS-IO ESP32 (U100.8)
INP6: HS-IO Inputs (U200.12), HS-IO ESP32 (U100.9)
INP7: HS-IO Inputs (U201.2), HS-IO ESP32 (U100.10)
INP8: HS-IO Inputs (U201.4), HS-IO ESP32 (U100.11)
INP9: HS-IO Inputs (U201.6), HS-IO ESP32 (U100.12)
INP10: HS-IO Inputs (U201.8), HS-IO ESP32 (U100.13)
INP11: HS-IO Inputs (U201.10), HS-IO ESP32 (U100.15)
INP12: HS-IO Inputs (U201.12), HS-IO ESP32 (U100.16)
~{RESET}: HS-IO Inputs (J202.4), HS-IO Outputs (R302.2 R306.2), HS-IO ESP32 (P101.14 U100.40)

## Assembly variants
Teilbestückt: not fitted 12V C102 J200 J201 J202 J300 J301 J302 K300 K301 K302 K303 K304 K305 K306 K307 K308 K309 K310 K311 R252 R253 U100 U102